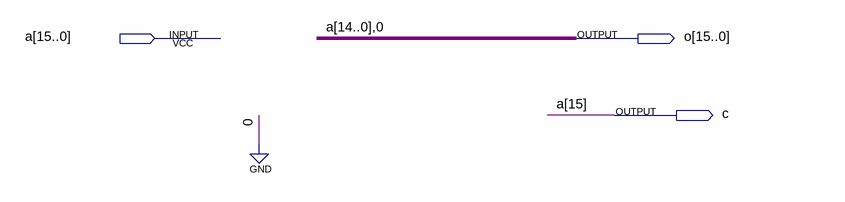
[diagram p0: schematic sheet]
// Quartus schematic LOG_SL16.bdf as structural Verilog: 0 symbols, 3 pins
module LOG_SL16 (
  input  [15:0] a,
  output [15:0] o,
  output c
);


  assign c = a[15];
  assign o = {a[14:0], 1'b0};
endmodule
